# Altium schematic sheet Power.SchDoc
size A
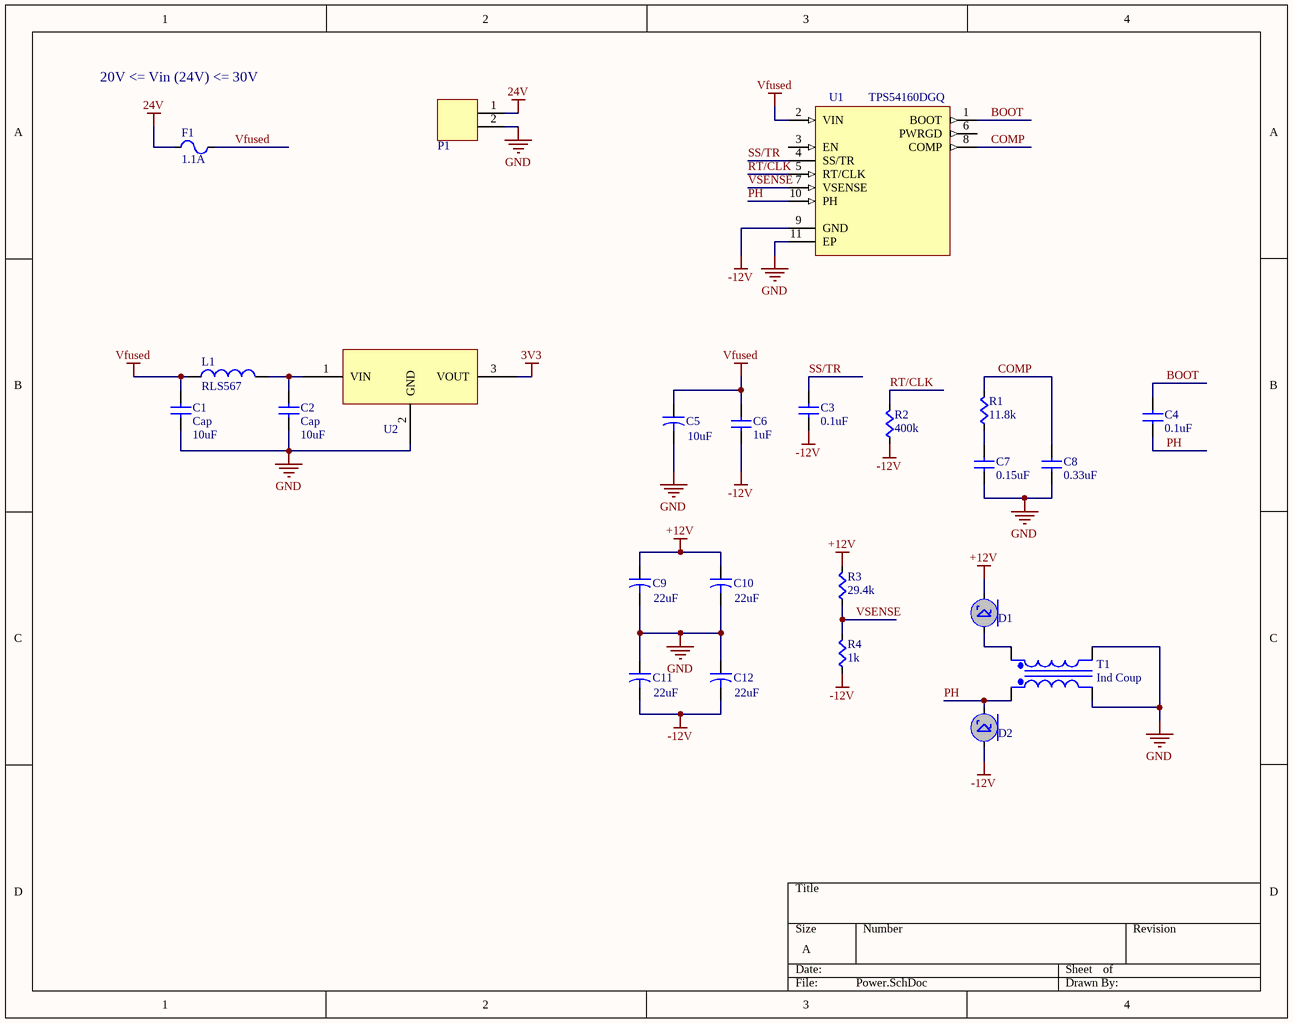
[diagram p0: Power.SchDoc]

## Parts
C1  Cap  value 10uF  [CAP1210]
C2  Cap  value 10uF  [CAP1210]
C3  value 0.1uF  [CAPC0603]  (hidden comment: EEHZA1H101P)
C4  value 0.1uF  [CAPC0603]  (hidden comment: Cap)
C5  value 10uF  [CAPR5-4X5]  (hidden comment: Cap2)
C6  value 1uF  [CAPC0603]  (hidden comment: Cap)
C7  value 0.15uF  [CAPC0603]  (hidden comment: Cap)
C8  value 0.33uF  [CAPC0603]  (hidden comment: Cap)
C9  value 22uF  [CAPR5-4X5]  (hidden comment: Cap2)
C10  value 22uF  [CAPR5-4X5]  (hidden comment: Cap2)
C11  value 22uF  [CAPR5-4X5]  (hidden comment: Cap2)
C12  value 22uF  [CAPR5-4X5]  (hidden comment: Cap2)
D1  Schottky  [DSS16UTR]  (value not drawn)
D2  Schottky  [DSS16UTR]  (value not drawn)
F1  value 1.1A  [PTC7451X11N]  (hidden comment: PTC Fuse)
L1  Inductor  [RLS567]  (value not drawn)
P1  2-pin Vert Sherlock  [MOLEX-HDR-1X2-SHERLOCK-VERT]  (value not drawn)
R1  value 11.8k  [RES1206]  (hidden comment: Res)
R2  value 400k  [RES1206]  (hidden comment: Res)
R3  value 29.4k  [RES1206]  (hidden comment: Res)
R4  value 1k  [RES0603]  (hidden comment: Res)
T1  Ind Coup  [SOP4]
U1  TPS54160DGQ  [SOIC-11]
U2  R-78C3.3-1.0  [R-78C3.3-1.0]  (value not drawn)

## Nets
3V3: U2.3(VOUT)
24V: F1.1(A) P1.1
+12V: C9.1 C10.1 D1.C R3.1(A)
-12V: C3.2(B) C6.2(B) C11.2 C12.2 D2.A R2.2(B) R4.2(B) U1.9(GND)
GND: C1.2(B) C2.2(B) C5.2 C7.2(B) C8.2(B) C9.2 C10.2 C11.1 C12.1 P1.2 T1.1(Pri-) T1.2(Sec-) U1.11(EP) U2.2(GND)
Vfused: C1.1(A) C5.1 C6.1(A) F1.2(B) L1.1(A) U1.2(VIN)
BOOT: C4.1(A) U1.1(BOOT)
COMP: C8.1(A) R1.1(A) U1.8(COMP)
PH: C4.2(B) D2.C T1.4(Pri+) U1.10(PH)
RT/CLK: R2.1(A) U1.5(RT/CLK)
SS/TR: C3.1(A) U1.4(SS/TR)
VSENSE: R3.2(B) R4.1(A) U1.7(VSENSE)
NetC2_1: C2.1(A) L1.2(B) U2.1(VIN)
NetC7_1: C7.1(A) R1.2(B)
NetD1_A: D1.A T1.3(Sec+)

Not connected (* = marked no-connect by the designer): U1 3(EN) 6(PWRGD)

## Notes on the sheet
- 20V <= Vin (24V) <= 30V

## Library data of the parts
C1 C2 = CAP1210: CAP CER 10UF 50V 20% X5R 1210; Supplier 1: Digi-Key; Supplier Part Number 1: 587-2225-1-ND
C3 = Cap: Supplier 1: Digi-Key; Supplier Part Number 1: 1276-1000-1-ND
C5 C9-C12 = Cap2: Capacitor; Published: 23-Sep-2002; PackageReference: CAPR5-4X5; Publisher: Altium Limited; PackageDescription: Capacitor; 2 Leads
D1 D2 = Schottky: Schottky Diode Template
F1 = PTC_Fuse: Supplier 1: Digi-Key; Supplier Part Number 1: 507-1744-1-ND
P1 = MOLEX-HDR-1x2-SHERLOCK_VERT: Header, Molex, 2mm Pitch Sherlock Header, Single Row, Vertical, 2 Circuits, Length 3.3mm, 0353620250; Manufacturer Part Number: *; Order Part Number: *
T1 = Trans Cupl: Transformer (Coupled Inductor Model); Published: 8-Jun-2000; LatestRevisionDate: 17-Jul-2002; LatestRevisionNote: Re-released for DXP Platform.; PackageReference: TRF_4; Publisher: Altium Limited; PackageDescription: Transformer; 4 Leads
U1 = TPS54160DGQ: Buck Switching Regulator IC Positive Adjustable 0.8V 1 Output 1.5A 10-TFSOP, 10-MSOP _0.118, 3.00mm Width_ Exposed Pad; MF: Texas Instruments; Availability: Unavailable; Package: TFSOP-10 Texas Instruments; SnapEDA_Link: https://www.snapeda.com/parts/TPS54160DGQ/Texas%20Instruments/view-part/393939/?ref=snap; Price: None; Value: *; MP: TPS54160DGQ
U2 = R-78C3.3-1.0: CONV DC/DC 1A 3.3V OUT SIP VERT; Supplier 1: Digi-Key; Supplier Part Number 1: 945-1394-5-ND
C4 C6-C8 = Cap: Supplier 1: Digi-Key; Supplier Part Number 1: 1276-1000-1-ND
L1 = Inductor: Supplier 1: Digi-Key; Supplier Part Number 1: ?; Inductance: RLS567
R1-R4 = Res: Supplier 1: Digi-Key; Supplier Part Number 1: RMCF0603JT10K0CT-ND